# EAGLE schematic TinyISD1700_V2_2020-08-10-smd-sop (EAGLE 6.4)
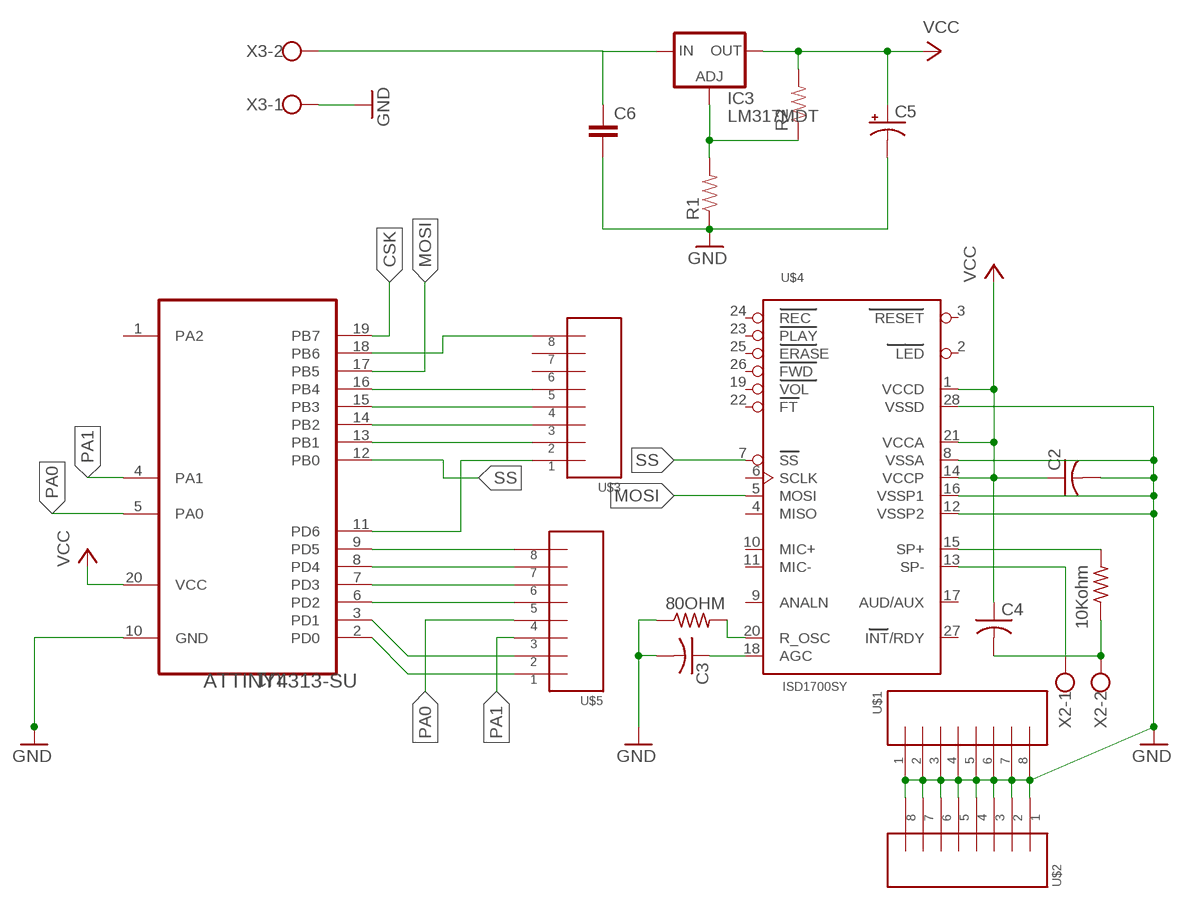
[diagram p0: schematic, sheet 1]

## Parts
80OHM  R-US_0204/2V  [0204V]
80OHM1  10Kohm  R-US_0204/2V  [0204V]
C2  C-US050-030X075  [C050-030X075]
C3  C-US050-030X075  [C050-030X075]
C4  C-US050-030X075  [C050-030X075]
C5  CAP_POL1206  [EIA3216]
C6  CAP0805  [0805]
IC3  LM317MDT  [DPACK]
R1  RESISTOR  [0805]
R2  RESISTOR  [0805]
U1  ATTINY4313-SU  [SOIC127P1032X265-20N]
U$1  8PIN_HEADER  [8PIN_HEADER]
U$2  8PIN_HEADER  [8PIN_HEADER]
U$3  8PIN_HEADER  [8PIN_HEADER]
U$4  ISD1700SY  [SO28W]
U$5  8PIN_HEADER  [8PIN_HEADER]
X2  W237-102  [W237-102]
X3  W237-102  [W237-102]

## Nets
CSK: U1.19(PB7)
GND: 80OHM.1 C2.2 C3.2 C5.C(-) C6.2 R1.1 U1.10(GND) U$1.P$1 U$1.P$2 U$1.P$3 U$1.P$4 U$1.P$5 U$1.P$6 U$1.P$7 U$1.P$8 U$2.P$1 U$2.P$2 U$2.P$3 U$2.P$4 U$2.P$5 U$2.P$6 U$2.P$7 U$2.P$8 U$4.8(VSSA) U$4.12(VSSP2) U$4.16(VSSP1) U$4.28(VSSD) X3.1
MOSI: U1.17(PB5) U$4.5(MOSI)
N$1: 80OHM.2 U$4.20(R_OSC)
N$2: U1.13(PB1) U$3.P$2
N$3: U1.14(PB2) U$3.P$3
N$4: 80OHM1.1 C4.2 X2.2
N$5: C3.1 U$4.18(AGC)
N$6: U$4.13(SP-) X2.1
N$7: 80OHM1.2 U$4.15(SP+)
N$8: U1.15(PB3) U$3.P$4
N$9: U1.11(PD6) U$3.P$1
N$11: U1.9(PD5) U$5.P$8
N$12: U1.8(PD4) U$5.P$7
N$13: U1.7(PD3) U$5.P$6
N$14: U1.6(PD2) U$5.P$5
N$15: U1.3(PD1) U$5.P$2
N$16: U1.2(PD0) U$5.P$1
N$20: U1.16(PB4) U$3.P$5
N$28: C6.1 X3.2
N$29: IC3.1(ADJ) R1.2 R2.1
PA0: U1.5(PA0) U$5.P$4
PA1: U1.4(PA1) U$5.P$3
Q: U1.18(PB6) U$3.P$8
SS: U1.12(PB0) U$4.7(SS)
VCC: C2.1 C4.1 C5.A(+) IC3.4(OUT) R2.2 U1.20(VCC) U$4.1(VCCD) U$4.14(VCCP) U$4.21(VCCA)
Unconnected: IC3.3(IN) U1.1(PA2) U$3.P$6 U$3.P$7 U$4.2(LED) U$4.3(RESET) U$4.4(MISO) U$4.6(SCLK) U$4.9(ANALN) U$4.10(MIC+) U$4.11(MIC-) U$4.17(AUD/AUX) U$4.19(VOL) U$4.22(FT) U$4.23(PLAY) U$4.24(REC) U$4.25(ERASE) U$4.26(FWD) U$4.27(INT/RDY)

## Library data of the parts
80OHM 80OHM1 = rcl:R-US_: RESISTOR, American symbol; OC_FARNELL: unknown
C2-C4 = resistor:C-US: CAPACITOR, American symbol; OC_FARNELL: unknown
C5 = SparkFun2:CAP_POL: Capacitor Polarized These are standard SMD and PTH capacitors. Normally 10uF, 47uF, and 100uF in electrolytic and tantalum varieties. Always verify the external diameter of the through hole cap, it varies with capacity, voltage, and manufacturer. The EIA devices should be standard.
C6 = SparkFun2:CAP: Capacitor Standard 0603 ceramic capacitor, and 0.1" leaded capacitor.
IC3 = v-reg:LM317?*: 500 mA Adjustable Output Positive Voltage Regulator Source: http://www.onsemi.co.jp .. LM317M-D.PDF
R1 R2 = SparkFun2:RESISTOR: Resistor Basic schematic elements and footprints for 0603, 1206, and PTH 1/10th watt (small) resistors.
U1 = Atmel_By_element14_Batch_1-00:ATTINY4313-SU: 8-bit Microcontroller with In-System Programmable Flash; MF: MICROCHIP; MPN: ATTINY4313-SU; OC_FARNELL: 1841621; OC_NEWARK: 12T1340; PACKAGE: SOIC-20; SUPPLIER: Atmel
U$1-U$3 U$5 = arduino:8PIN_HEADER; MF: RENESAS; MPN: YSDKS128E10; OC_FARNELL: 2946736
U$4 = isd-new-1:ISD1700; OC_FARNELL: unknown
X2 X3 = con-wago-500:W237-102: WAGO SCREW CLAMP; OC_FARNELL: unknown; OC_NEWARK: 70K9898